# Altium schematic sheet 08_AFBUS.SchDoc
size A4; Revision: A
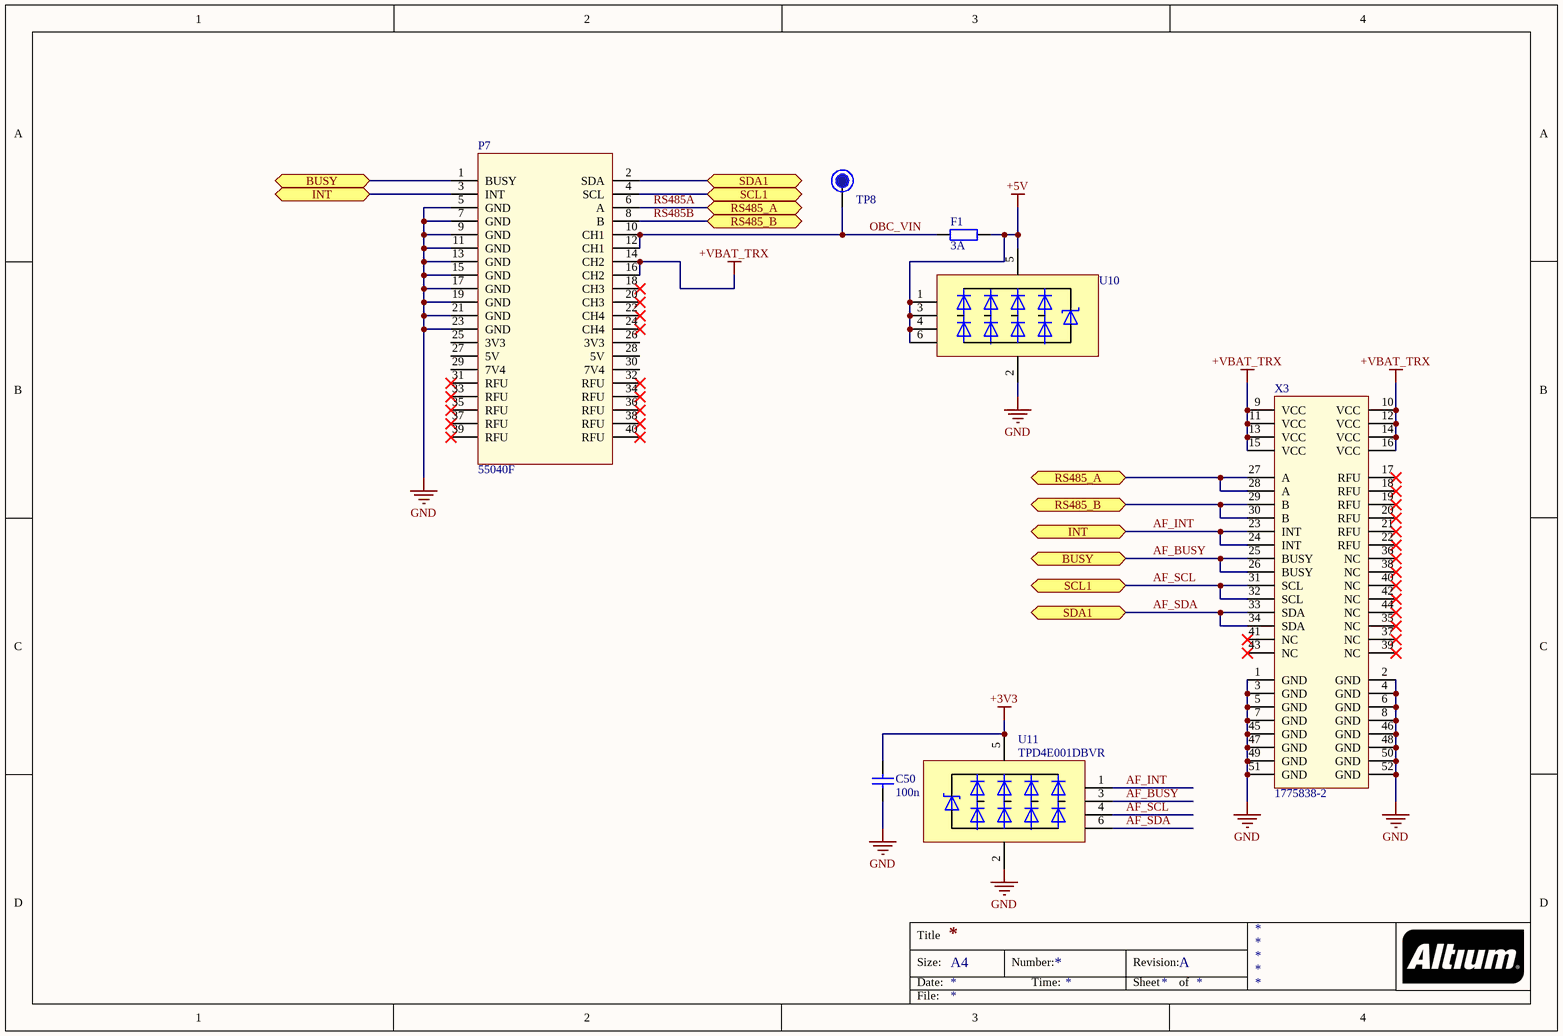
[diagram p0: 08_AFBUS.SchDoc]

## Parts
C50  100n  [C0603_IPC_HD]
F1  3A  [F0603_IPC_MD]
P7  55040F  [HEADER_40PIN_12MM2]
TP8  VIN  [TestPoint_1M5]  (value not drawn)  (no BOM)
U10  TPD4E001DBVR  [SOT23-6]  (value not drawn)
U11  TPD4E001DBVR  [SOT23-6]
X3  1775838-2  [1775838-2]

## Ports
BUSY (bidir), INT (bidir), RS485_A (bidir), RS485_B (bidir), SCL1 (bidir), SDA1 (bidir)

## Nets
+3V3: C50.2 U11.5(VCC)
+5V: F1.2 U10.1(IO1) U10.3(IO2) U10.4(IO3) U10.5(VCC) U10.6(IO4)
+VBAT_TRX: P7.14(CH2) P7.16(CH2) X3.9(VCC) X3.10(VCC) X3.11(VCC) X3.12(VCC) X3.13(VCC) X3.14(VCC) X3.15(VCC) X3.16(VCC)
GND: C50.1 P7.5(GND) P7.7(GND) P7.9(GND) P7.11(GND) P7.13(GND) P7.15(GND) P7.17(GND) P7.19(GND) P7.21(GND) P7.23(GND) U10.2(GND) U11.2(GND) X3.1(GND) X3.2(GND) X3.3(GND) X3.4(GND) X3.5(GND) X3.6(GND) X3.7(GND) X3.8(GND) X3.45(GND) X3.46(GND) X3.47(GND) X3.48(GND) X3.49(GND) X3.50(GND) X3.51(GND) X3.52(GND)
AF_BUSY: P7.1(BUSY) U11.3(IO2) X3.25(BUSY) X3.26(BUSY) ; port BUSY
AF_INT: P7.3(INT) U11.1(IO1) X3.23(INT) X3.24(INT) ; port INT
AF_SCL: P7.4(SCL) U11.4(IO3) X3.31(SCL) X3.32(SCL) ; port SCL1
AF_SDA: P7.2(SDA) U11.6(IO4) X3.33(SDA) X3.34(SDA) ; port SDA1
OBC_VIN: F1.1 P7.10(CH1) P7.12(CH1) TP8.0
RS485A: P7.6(A) X3.27(A) X3.28(A) ; port RS485_A
RS485B: P7.8(B) X3.29(B) X3.30(B) ; port RS485_B

Not connected (* = marked no-connect by the designer): P7 18(CH3)* 20(CH3)* 22(CH4)* 24(CH4)* 25(3V3) 26(3V3) 27(5V) 28(5V) 29(7V4) 30(7V4) 31(RFU)* 32(RFU)* 33(RFU)* 34(RFU)* 35(RFU)* 36(RFU)* 37(RFU)* 38(RFU)* 39(RFU)* 40(RFU)*; X3 17(RFU)* 18(RFU)* 19(RFU)* 20(RFU)* 21(RFU)* 22(RFU)* 35(NC)* 36(NC)* 37(NC)* 38(NC)* 39(NC)* 40(NC)* 41(NC)* 42(NC)* 43(NC)* 44(NC)*

## Notes on the sheet
- Title
- Size:
- Date:
- A4
- Number:
- Time:
- Revision:
- Sheet
- of
- File:

## Library data of the parts
C50 = CL10B104KO8NNNC: CAP CER 0.1UF 16V X7R 0603; Manufacturer: Samsung Electro-Mechanics; Manufacturer Part Number: CL10B104KO8NNNC; Voltage: 16V; Value: 100n; Dielectric: X7R; Supplier 1: Digi-Key; Supplier Part Number 1: 1276-1005-1-ND
F1 = C2Q3: FUSE BRD MNT 3A 32VAC 63VDC 0603; Manufacturer: Bel Fuse Inc.; Value: 3A; Manufacturer Part Number: C2Q3; Supplier 1: Digi-Key; Supplier Part Number 1: 507-1096-1-ND
P7 = ALFASAT_BIC: CONN HEADER R/A 40POS 2.54MM; Manufacturer: On Shore Technology Inc.; Manufacturer Part Number: 55040F; Supplier 1: LCSC; Supplier Part Number 1: C35165
TP8 = TP: Test Point
U10 U11 = TPD4E001DBVR: 4x TVS DIODE 5.5V SOT23-6; Manufacturer: TI; Manufacturer Part Number: TPD4E001DBVR; Supplier 1: Digi-Key; Supplier Part Number 1: 296-28203-1-ND
X3 = ALAFASAT_TRX_PCI: CONN PCI EXP MINI FEMALE 52POS; Manufacturer: TE Connectivity AMP Connectors; Manufacturer Part Number: 1775838-2; Supplier 1: Digi-Key; Supplier Part Number 1: A123340CT-ND